# Altium project EE209_Prototype.PrjPcb
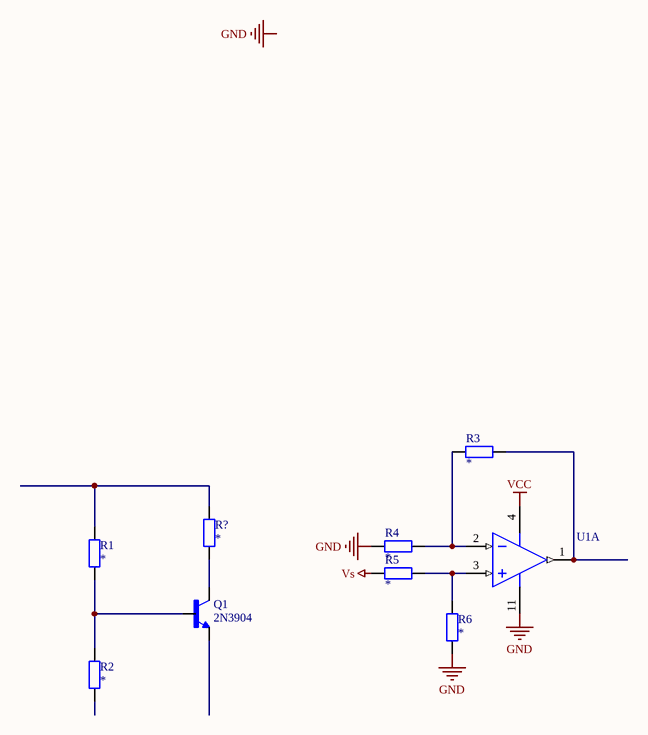
[diagram p0: EE209_Schematic.SchDoc]
1 sheet, 9 parts. Net scope: global (net labels, ports and power ports of the same name join across sheets).
Board file: EE209_PCB.PcbDoc

## Sheet EE209_Schematic.SchDoc: Wireless Energy Monitor
size A3; Author: Team XX; Organization: EE/CS 209 Class of 2022; Address1: Department of ECSE; Address2: The University of Auckland; Address3: 20 Symonds Street; Address4: Auckland, NZ; Revision: 1.0; SheetNumber: 1; SheetTotal: 1

### Parts
Q1  2N3904  [TO92254P460H750-3]
R1  *  [AXIAL-0.4]
R2  *  [AXIAL-0.4]
R3  *  [AXIAL-0.4]
R4  *  [AXIAL-0.4]
R5  *  [AXIAL-0.4]
R6  *  [AXIAL-0.4]
R?  *  [AXIAL-0.4]
U1  LM324  [DIP-14]  (value not drawn)  (part A of 4)

### Nets
GND: R4.1 R6.2 U1.11(VSS)
VCC: U1.4(VDD)
Vs: R5.1
NetQ1_2: Q1.2(B) R1.1 R2.2
NetQ1_3: Q1.3(C) R?.1
NetR1_2: R1.2 R?.2
NetR3_1: R3.1 R4.2 U1.2(VINA-)
NetR3_2: R3.2 U1.1(VOUTA)
NetR5_2: R5.2 R6.1 U1.3(VINA+)

Not connected (* = marked no-connect by the designer): Q1 1(E); R2 1

### Notes on the sheet
- Labels drawn without touching a wire or pin: GND
- Title:
- Author:
- Date:
- Time:
- Revision:
- Sheet
- of
- File:

### Library data of the parts
Q1 = 2N3904: BJT, TO-92, 40V, 200mA, NPN, 0.625W, 150Â°C; MF: Diotec Semiconductor; SnapEDA_Link: https://www.snapeda.com/parts/2N3904/Diotec/view-part/?ref=snap; Package: TO-92 Diotec; Value: *; MP: 2N3904; Check_prices: https://www.snapeda.com/parts/2N3904/Diotec/view-part/?ref=eda
R1-R6 R? = Res_TH_0AX4: Through hole resistor; Published: 8-Jun-2000; LatestRevisionDate: 17-Jul-2002; LatestRevisionNote: Re-released for DXP Platform.; PackageReference: AXIAL-0.4; Publisher: Altium Limited; Value: *; ComponentLink1Description: http://www.royalohm.com/pdf/product2017/PrecisionMetalMF.pdf
U1 = LM324N_TH_DIP16: IC OPAMP GP 14DIP; Manufacturer: ON Semiconductor; Manufacturer Part Number: LM324N; Amplifier Type: General Purpose; Current - Supply: 1mA; Voltage - Supply, Single/Dual (±): 3 V ~ 32 V, ±1.5 V ~ 16 V; Supplier 1: Digi-Key; RoHS: RoHS Compliant; Category: Integrated Circuits (ICs); Stock 1: 2900; Pricing 1: 1=0.9, 10=0.775, 100=0.5789, 500=0.45482, 1000=0.35145 (NZD); Packaging: Tube; Part Status: Active; Output Type: -; Slew Rate: -; Operating Temperature: 0°C ~ 70°C; Mounting Type: Through Hole; Package / Case: 14-DIP (0.300", 7.62mm); Supplier Device Package: 14-DIP; Base Part Number: LM324; ComponentLink1URL: https://www.fairchildsemi.com/datasheets/LM/LM2902.pdf; ComponentLink1Description: https://www.fairchildsemi.com/datasheets/LM/LM2902.pdf; Supplier Part Number 1: LM324NFS-ND